# Altium schematic sheet Schematic.SchDoc: =GlobalProjectName
size 209 x 297 mm; ApprovedBy: Утвердил; CheckedBy: Проверил; Author: Разработал; SheetNumber: Лист; SheetTotal: Листов; PageSetup: Record=PageOptions|CenterHorizontal=True|CenterVertical=True|PrintScale=1.00|XCorrection=1.00|YCorrection=1.00|PrintKind=1|BorderSize=5000000|LeftOffset=0|BottomOffset=0|Orientation=2|PaperLength=1000|PaperWidth=1000|Scale=100|PaperSource=15|PrintQuality=1200|MediaType=1|DitherType=10|PaperKind=A3|PrintScaleMode=1; Weight: -; ScaleFactor: -; NormInspection: Норм.Контр.
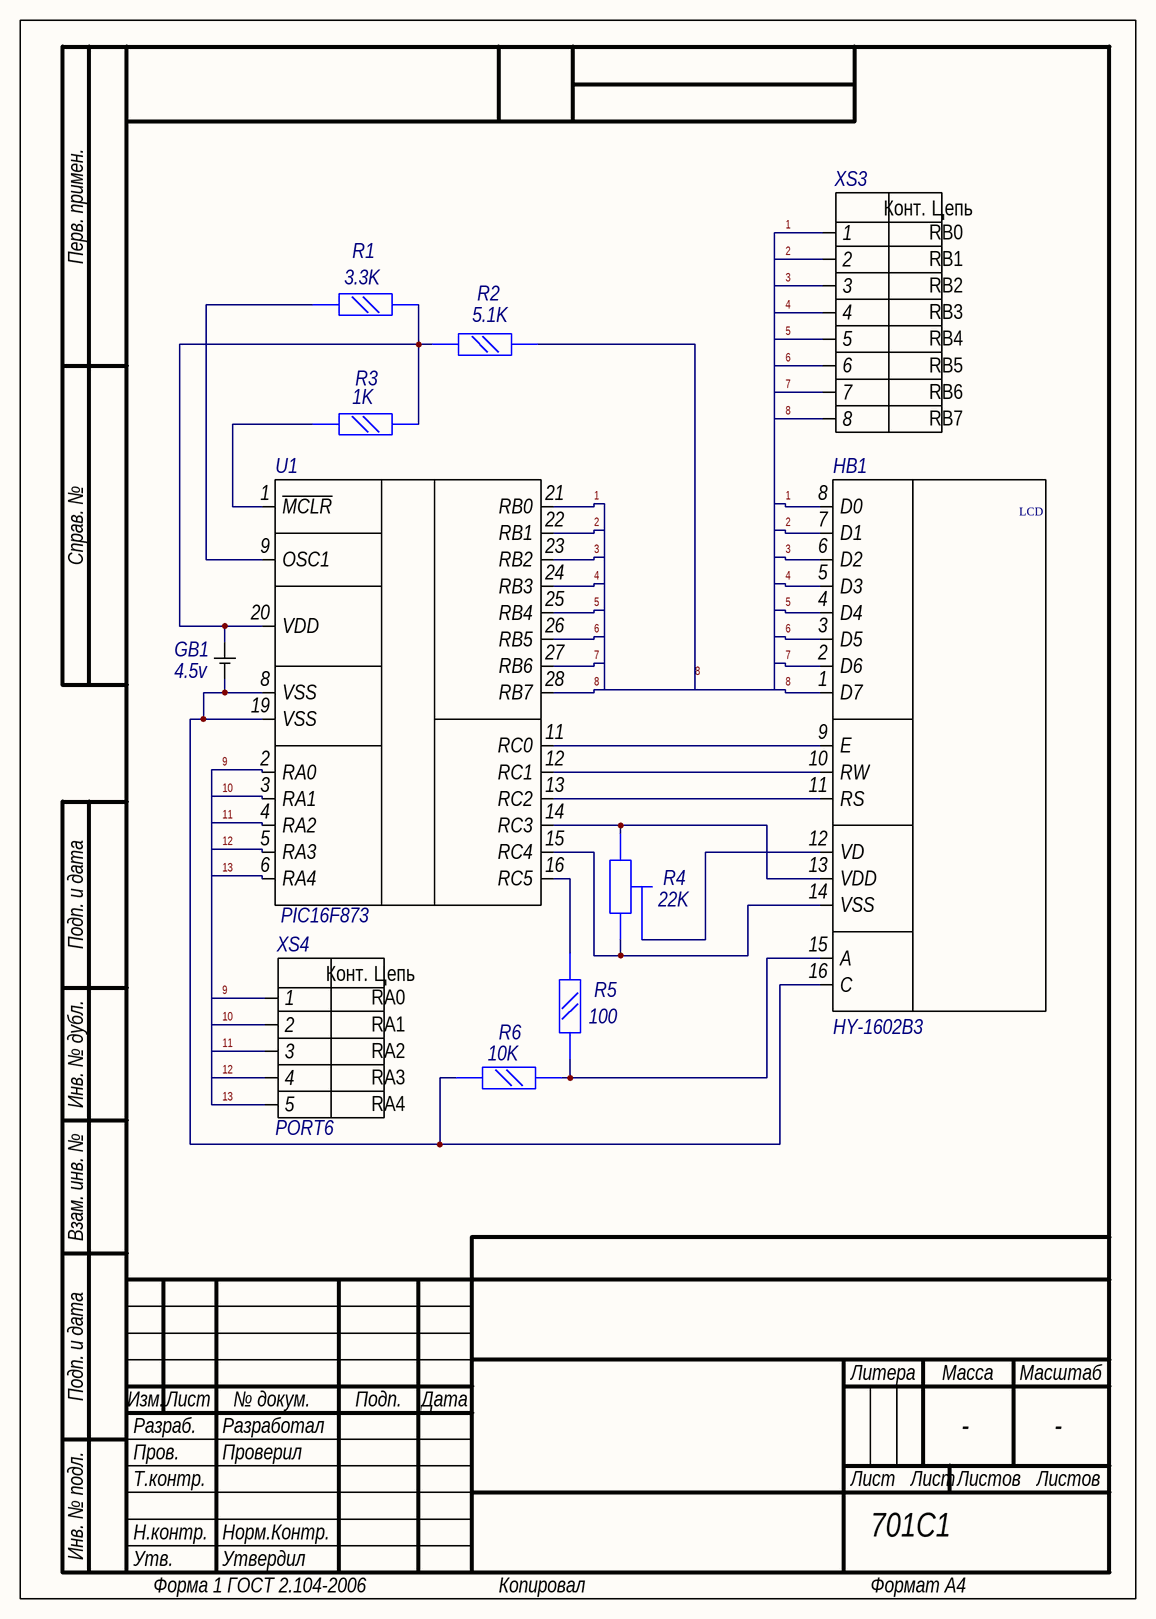
[diagram p0: Schematic.SchDoc]

## Parts
GB1  4.5v  [XS2holes]
HB1  HY-1602B3  [lcd-screen]
R1  3.3K  [R1206]
R2  5.1K  [R1206]
R3  1K  [R1206]
R4  22K  [SH-655MCL]
R5  100  [R1206]
R6  10K  [R1206]
U1  PIC16F873  [QFP44]
XS3  PORT8  [XS8HOLES]  (value not drawn)
XS4  PORT6  [XS5HOLES]

## Nets
1: HB1.8(D0) U1.21(RB0) XS3.1
2: HB1.7(D1) U1.22(RB1) XS3.2
3: HB1.6(D2) U1.23(RB2) XS3.3
4: HB1.5(D3) U1.24(RB3) XS3.4
5: HB1.4(D4) U1.25(RB4) XS3.5
6: HB1.3(D5) U1.26(RB5) XS3.6
7: HB1.2(D6) U1.27(RB6) XS3.7
8: HB1.1(D7) R2.2 U1.28(RB7) XS3.8
9: U1.2(RA0) XS4.1
10: U1.3(RA1) XS4.2
11: U1.4(RA2) XS4.3
12: U1.5(RA3) XS4.4
13: U1.6(RA4) XS4.5
NetGB1_1: GB1.1 R1.2 R2.1 R3.2 U1.20(VDD)
NetGB1_2: GB1.2 HB1.16(C) R6.2 U1.8(VSS) U1.19(VSS)
NetHB1_9: HB1.9(E) U1.11(RC0)
NetHB1_10: HB1.10(RW) U1.12(RC1)
NetHB1_11: HB1.11(RS) U1.13(RC2)
NetHB1_12: HB1.12(VD) R4.2
NetHB1_13: HB1.13(VDD) R4.3 U1.14(RC3)
NetHB1_14: HB1.14(VSS) R4.1 U1.15(RC4)
NetHB1_15: HB1.15(A) R5.1 R6.1
NetR1_1: R1.1 U1.9(OSC1)
NetR3_1: R3.1 U1.1(~{MCLR})
NetR5_2: R5.2 U1.16(RC5)

## Notes on the sheet
- Перв. примен.
- Справ. №
- Подп. и дата
- Инв. № дубл.
- Взам. инв. №
- Разраб.
- Изм.
- Лист
- № докум.
- Подп.
- Дата
- Литера
- Масса
- Масштаб
- Пров.
- Т.контр.
- Листов
- Инв. № подл.
- Н.контр.
- Утв.
- 701С1
- Форма 1 ГОСТ 2.104-2006
- Копировал
- Формат А4
- (in symbol HY-1602B3) LCD
- (in symbol PORT6) Конт.; Цепь; RA0; RA1; RA2; RA3; RA4
- (in symbol PORT8) Конт.; Цепь; RB0; RB1; RB2; RB3; RB4; RB5; RB6; RB7

## Library data of the parts
GB1 = BAT
R1-R3 R5 R6 = Resistor_0,125W: Published: 19.09.2014; Publisher: Andrew Danich; Type: Резистор
R4 = Resistor-Trimmer-1: Publisher: Andrew Danich; Type: Подстроечный резистор; Published: 27.07.2015